# Altium schematic sheet serial_port.SchDoc
size A4; SheetNumber: 3; SheetTotal: 3
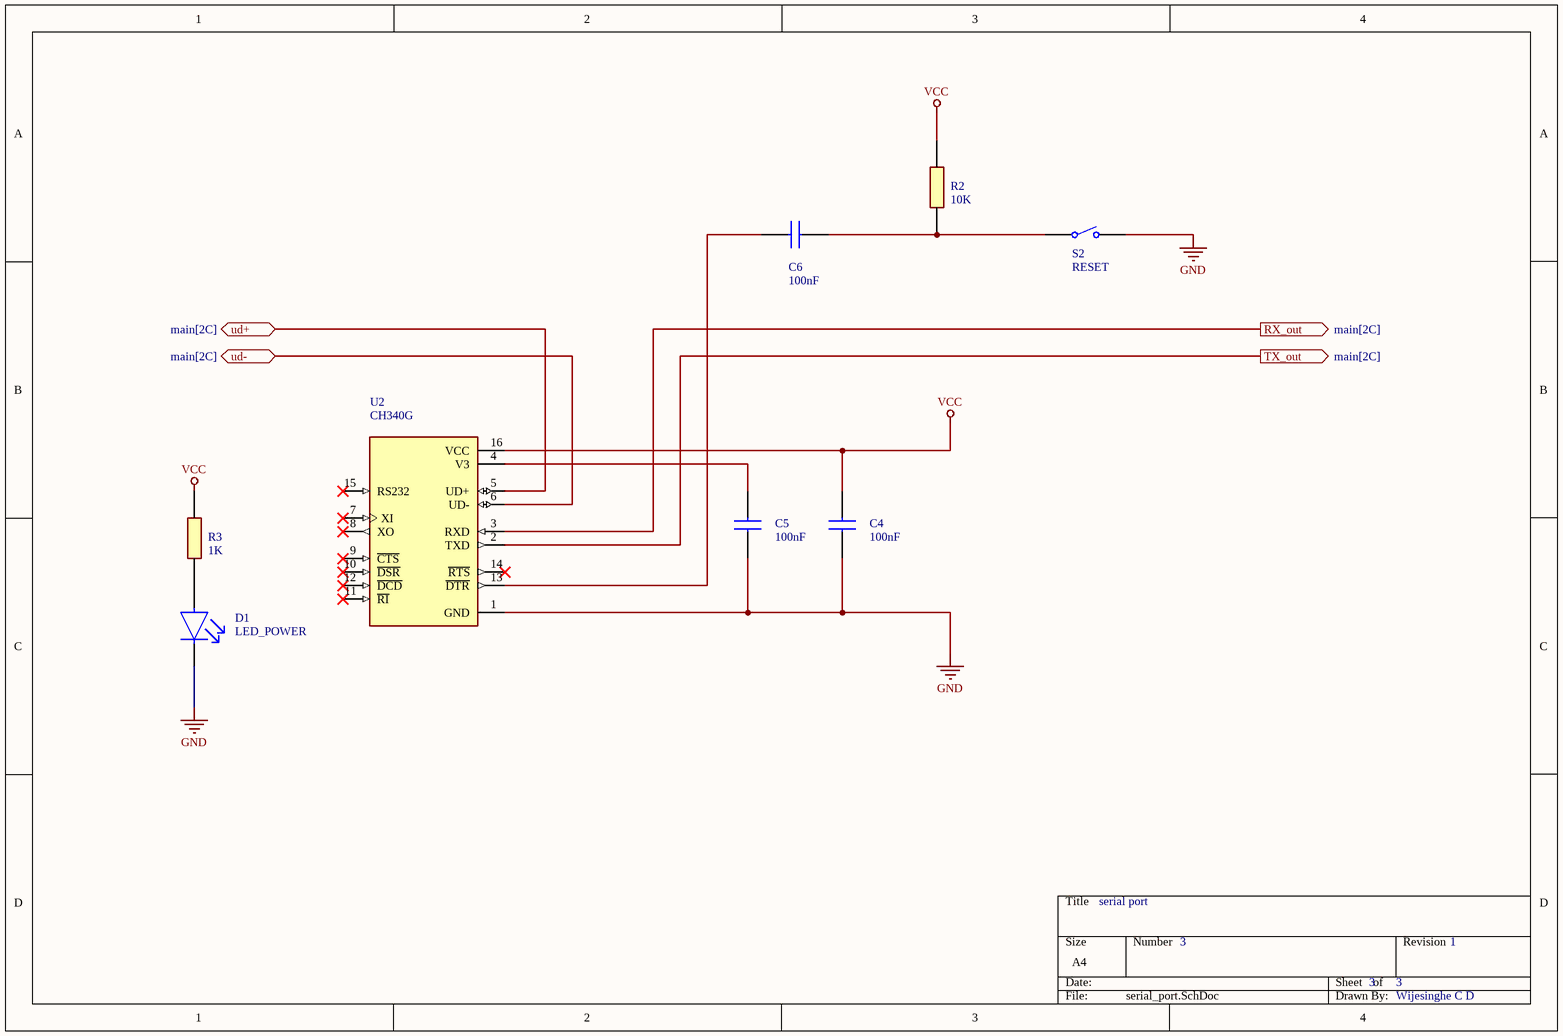
[diagram p0: serial_port.SchDoc]

## Parts
C4  100nF  [CAPC1608X90N]
C5  100nF  [CAPC1608X90N]
C6  100nF  [CAPC1608X90N]
D1  LED_POWER  [FP-LTST-C190GKT-MFG]
R2  10K  [RESC2012X75N]
R3  1K  [RESC2012X75N]
S2  RESET  [TECO-FSMSM-2_V]
U2  CH340G  [SOIC127P600X180-16N]

## Ports
RX_out (out, see main[2C]), TX_out (out, see main[2C]), ud+ (bidir, see main[2C]), ud- (bidir, see main[2C])

## Nets
GND: C4.2 C5.2 D1.1(C) S2.2 U2.1(GND)
VCC: C4.1 R2.2 R3.2 U2.16(VCC)
RX_out: U2.3(RXD) ; port RX_out
TX_out: U2.2(TXD) ; port TX_out
ud+: U2.5(UD+) ; port ud+
ud-: U2.6(UD-) ; port ud-
NetC5_1: C5.1 U2.4(V3)
NetC6_1: C6.1 U2.13(~{DTR})
NetC6_2: C6.2 R2.1 S2.1
NetD1_2: D1.2(A) R3.1

Not connected (* = marked no-connect by the designer): U2 7(XI)* 8(XO)* 9(~{CTS})* 10(~{DSR})* 11(~{RI})* 12(~{DCD})* 14(~{RTS})* 15(RS232)*

## Notes on the sheet
- serial port
- 3
- 1
- Wijesinghe C D

## Library data of the parts
C4-C6 = CL10B104JB8NNNC: Capacitor; Manufacturer_Name: SAMSUNG; Datasheet Link: https://datasheet.datasheetarchive.com/originals/distributors/Datasheets_SAMA/dd149ce8a6679b37799cedb31427d43d.pdf; Height: 0.9mm; Manufacturer_Part_Number: CL10B104JB8NNNC; Mouser Part Number: 187-CL10B104JB8NNNC; Mouser Price/Stock: https://www.mouser.co.uk/ProductDetail/Samsung-Electro-Mechanics/CL10B104JB8NNNC?qs=349EhDEZ59oLEw5wc1qvGw%3D%3D; Arrow Part Number: CL10B104JB8NNNC; Arrow Price/Stock: https://www.arrow.com/en/products/cl10b104jb8nnnc/samsung-electro-mechanics?region=nac
D1 = CMP-22017-000005-2: LED GREEN CLEAR CHIP SMD; Dominant Wavelength: 569nm; Reverse Voltage: 5V; Lens Color: Colorless; Viewing Angle: 130°; Voltage: 2V; Forward Current: 30mA; Power Dissipation: 100mW; Luminous Intensity: 6mcd; Number of LEDs: 1; Forward Voltage: 2.1V; Wavelength: 565nm; Test Current: 10mA; Min Operating Temperature: -55°C; Lens Style: Clear; Mount: Surface Mount; Width: 0.8mm; Packaging: Tape and Reel; Lens Transparency: Clear; Case Code (Metric): 1608; Depth: 0.8mm; Case Code (Imperial): 0603; Case/Package: 0603; Number of Pins: 2; Max Operating Temperature: 85°C; Lead Free: Lead Free; Number of Elements: 1; Length: 1.6mm; Height: 0.8mm; Package Quantity: 1; Power Rating: 100mW; Radiation Hardening: No; Illumination Color: Green; Color: Green
R2 R3 = ERJ-P6WF1002V: Resistor; Manufacturer_Name: Panasonic; Datasheet Link: https://datasheet.datasheetarchive.com/originals/distributors/DKDS-25/487413.pdf; Height: 0.75mm; Manufacturer_Part_Number: ERJ-P6WF1002V; Mouser Part Number: 667-ERJ-P6WF1002V; Mouser Price/Stock: https://www.mouser.co.uk/ProductDetail/Panasonic/ERJ-P6WF1002V?qs=%252B9%2Fcbd0IE0SZfBV6iDIV5A%3D%3D; Arrow Part Number: ERJ-P6WF1002V; Arrow Price/Stock: https://www.arrow.com/en/products/erj-p6wf1002v/panasonic?region=nac
S2 = CMP-2000-07511-1: FSMSM Push Button Switch, 50 mA, -35 to 85 degC, 2-Pin SMD, RoHS, Bulk; Manufacturer: TE Connectivity; Actuator Length: 1.07mm; Electrical Life: 20000Cycles; Actuator Material: Polyamide; Current Rating: 50mA; Illumination Type: Illuminated; Voltage Rating (DC): 24V; Contact Resistance: 100mOhm; Case\/Package: SMD/SMT; Operating Force: 180gf; Switch Travel: 0.25mm; Max Voltage Rating (DC): 12V; Throw Configuration: SPST; Packaging: LoosePiece; Max Operating Temperature: 85degC; ELV: Compliant; Package Description: 2-Pin Surface Mount Device, Body 6 x 3.5 mm, Pitch 9.19 mm; RoHSCompliant: true; Manufacturer URL: http://www.te.com/; Contact Plating: Silver; Contact Material: Brass; Mounting Technology: SurfaceMount; Contact Current Rating: 50mA; Datasheet Version: Rev. C2, 08/2014; Datasheet URL: http://www.te.com/commerce/DocumentDelivery/DDEController?Action=showdoc&DocId=Customer+Drawing%7F1437566-3%7FC2%7Fpdf%7FEnglish%7FENG_CD_1437566-3_C2_1437566_3_1_c.dwg.pdf%7F1437566-3; Mechanical Life: 20000Cycles; Package Reference: FSMSM; REACH SVHC: Unknown; Orientation: Straight; Min Operating Temperature: -35degC; Lead Free: LeadFree; Termination: GullWing; Package Quantity: 1000; Mount: SurfaceMount
U2 = CH340G: USB Interface Integrated Circuit; MF: WCH; Value: *; SnapEDA_Link: https://www.snapeda.com/parts/Ch340G/WCH/view-part/?ref=snap; MP: Ch340G; Check_prices: https://www.snapeda.com/parts/Ch340G/WCH/view-part/?ref=eda; Availability: Not in stock; Price: None; Package: None